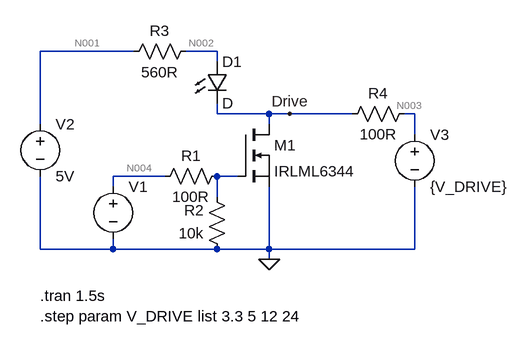
[diagram p0: schematic FET-LED_check.asc]
FET-LED_check.asc, the LTspice schematic file:
Version 4
SHEET 1 920 680
WIRE 320 160 176 160
WIRE 448 160 400 160
WIRE 448 176 448 160
WIRE 448 256 448 240
WIRE 528 256 448 256
WIRE 560 256 528 256
WIRE 656 256 560 256
WIRE 752 256 736 256
WIRE 176 272 176 160
WIRE 528 272 528 256
WIRE 752 288 752 256
WIRE 368 352 288 352
WIRE 480 352 448 352
WIRE 288 368 288 352
WIRE 448 384 448 352
WIRE 176 464 176 352
WIRE 288 464 288 448
WIRE 288 464 176 464
WIRE 448 464 288 464
WIRE 528 464 528 368
WIRE 528 464 448 464
WIRE 752 464 752 368
WIRE 752 464 528 464
WIRE 528 480 528 464
FLAG 528 480 0
FLAG 560 256 Drive
SYMBOL nmos 480 272 R0
SYMATTR InstName M1
SYMATTR Value IRLML6344
SYMBOL res 464 336 R90
WINDOW 0 0 56 VBottom 2
WINDOW 3 32 56 VTop 2
SYMATTR InstName R1
SYMATTR Value 100R
SYMBOL res 464 480 R180
WINDOW 0 36 76 Left 2
WINDOW 3 36 40 Left 2
SYMATTR InstName R2
SYMATTR Value 10k
SYMBOL voltage 288 352 R0
WINDOW 3 24 96 Invisible 2
SYMATTR InstName V1
SYMATTR Value PULSE(0 3.3 {V_DRIVE *0.05} 100ns 100ns 75ms 5 1)
SYMATTR Value2 AC 3.3 0
SYMBOL voltage 176 256 R0
SYMATTR InstName V2
SYMATTR Value 5V
SYMBOL voltage 752 272 R0
SYMATTR InstName V3
SYMATTR Value {V_DRIVE}
SYMBOL LED 432 176 R0
SYMATTR InstName D1
SYMBOL res 416 144 R90
WINDOW 0 0 56 VBottom 2
WINDOW 3 32 56 VTop 2
SYMATTR InstName R3
SYMATTR Value 560R
SYMBOL res 752 240 R90
WINDOW 0 0 56 VBottom 2
WINDOW 3 32 56 VTop 2
SYMATTR InstName R4
SYMATTR Value 100R
TEXT 176 536 Left 2 !.tran 1.5s\n.step param V_DRIVE list 3.3 5 12 24

The netlist it stands for:
* FET-LED_check.asc
M1 Drive N005 0 0 IRLML6344
R1 N005 N004 100R
R2 0 N005 10k
V1 N004 0 PULSE(0 3.3 {V_DRIVE *0.05} 100ns 100ns 75ms 5 1) AC 3.3 0
V2 N001 0 5V
V3 N003 0 {V_DRIVE}
D1 N002 Drive D
R3 N002 N001 560R
R4 N003 Drive 100R
.model D D
.lib standard.dio
.model NMOS NMOS
.model PMOS PMOS
.lib standard.mos
.tran 1.5s
.step param V_DRIVE list 3.3 5 12 24
.backanno
.end

* Results of the author's LTspice run, read from the files saved beside the schematic
* Operating Point (first step), zero values left out:
*   v_drive = 3.3 
*   V(drive) = 3.457 V
*   V(n001) = 5 V
*   V(n003) = 3.3 V
*   V(n002) = 4.123 V
*   Id(M1) = 809.8 pA
*   Is(M1) = -809.8 pA
*   I(D1) = 1.566 mA
*   I(R4) = -1.566 mA
*   I(R3) = -1.566 mA
*   I(V3) = 1.566 mA
*   I(V2) = -1.566 mA
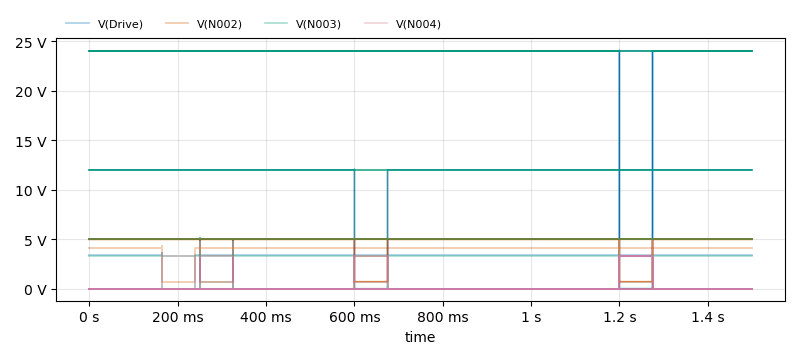
[diagram p1: Transient Analysis of FET-LED_check.asc, plotted from the saved traces]
* Transient Analysis, 4 runs:
*   V(Drive) [v_drive=3.3]: min 1.02 mV, max 3.619 V, average 3.284 V, rms 3.369 V, last 3.457 V
*   V(Drive) [v_drive=5]: min 1.528 mV, max 5.145 V, average 4.75 V, rms 4.873 V, last 5 V
*   V(Drive) [v_drive=12]: min 3.469 mV, max 12.09 V, average 11.4 V, rms 11.7 V, last 12 V
*   V(Drive) [v_drive=24]: min 6.768 mV, max 24.07 V, average 22.8 V, rms 23.39 V, last 24 V
*   V(N002) [v_drive=3.3]: min 708.8 mV, max 4.281 V, average 3.953 V, rms 4.022 V, last 4.123 V
*   V(N002) [v_drive=5]: min 709.3 mV, max 5 V, average 4.785 V, rms 4.876 V, last 5 V
*   V(N002) [v_drive=12]: min 711.2 mV, max 5 V, average 4.786 V, rms 4.876 V, last 5 V
*   V(N002) [v_drive=24]: min 714.5 mV, max 5 V, average 4.786 V, rms 4.876 V, last 5 V
*   V(N003) [v_drive=3.3]: min 3.3 V, max 3.3 V, average 3.3 V, rms 3.3 V, last 3.3 V
*   V(N003) [v_drive=5]: min 5 V, max 5 V, average 5 V, rms 5 V, last 5 V
*   V(N003) [v_drive=12]: min 12 V, max 12 V, average 12 V, rms 12 V, last 12 V
*   V(N003) [v_drive=24]: min 24 V, max 24 V, average 24 V, rms 24 V, last 24 V
*   V(N004) [v_drive=3.3]: min 0 V, max 3.3 V, average 165 mV, rms 737.9 mV, last 0 V
*   V(N004) [v_drive=5]: min 0 V, max 3.3 V, average 165 mV, rms 737.9 mV, last 0 V
*   V(N004) [v_drive=12]: min 0 V, max 3.3 V, average 165 mV, rms 737.9 mV, last 0 V
*   V(N004) [v_drive=24]: min 0 V, max 3.3 V, average 165 mV, rms 737.9 mV, last 0 V